# Altium project IPG.PrjPcb (part 3 of 13)

## Sheet 04-BLE.SchDoc: BLE Transreciver
size A3; DocumentNumber: 4; SheetNumber: 4; SheetTotal: 15
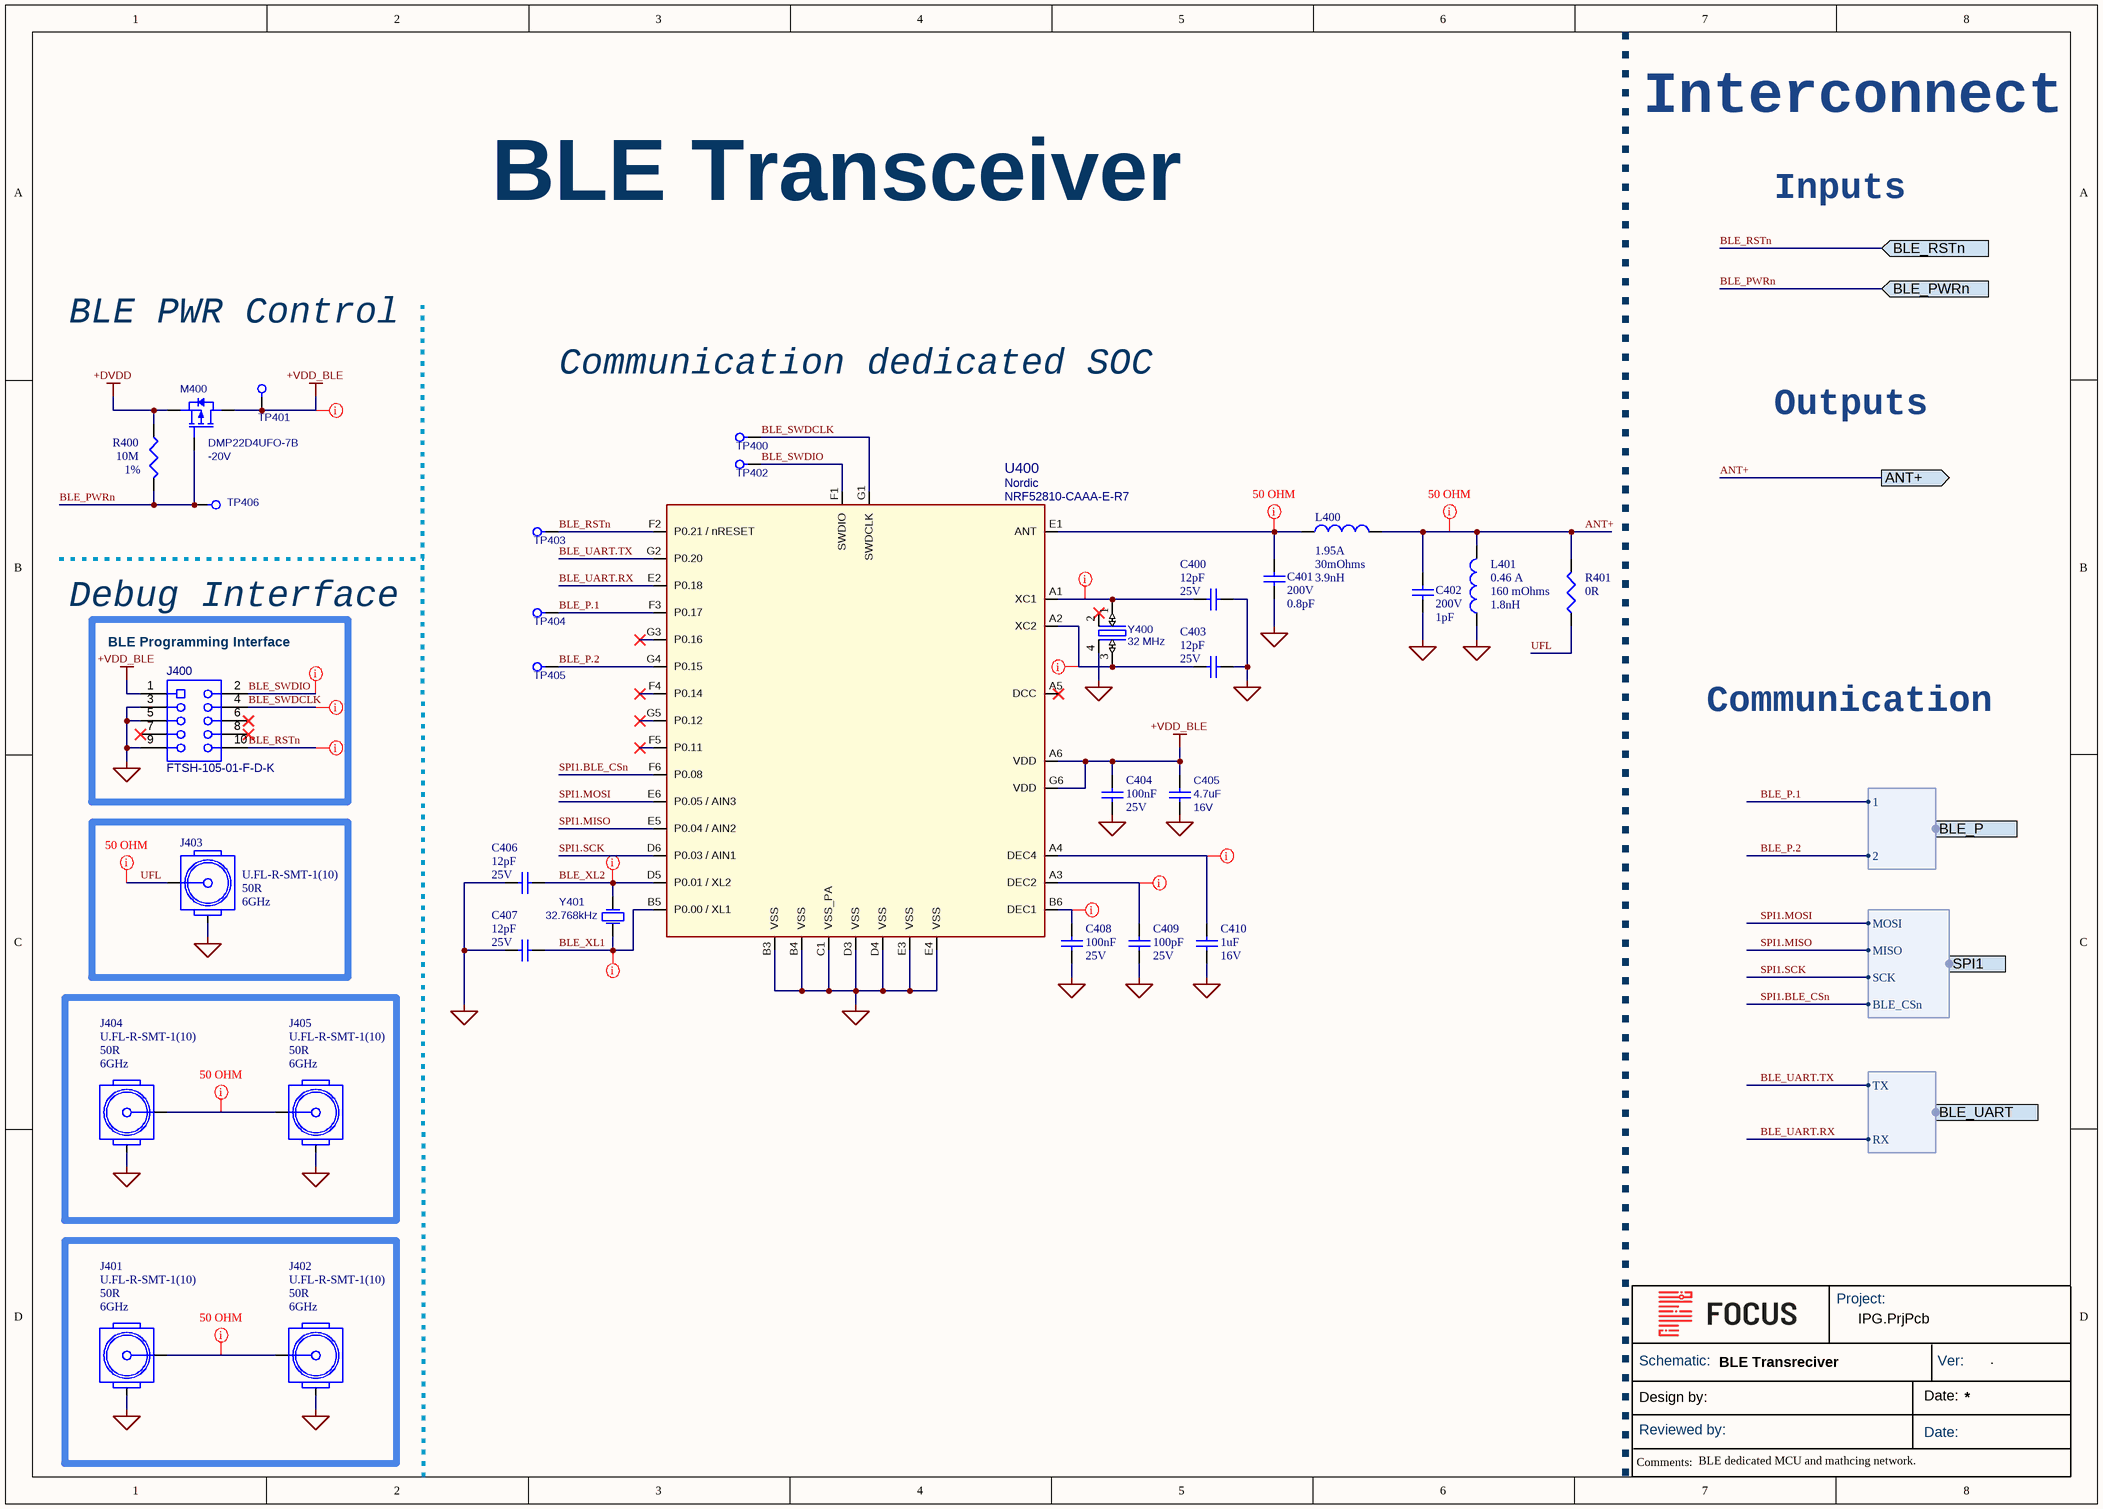
[diagram p9: 04-BLE.SchDoc]

### Parts
C400  value 12pF  Rated DC Voltage (URdc): 25V  [C0201_C]  (hidden comment: GRM0335C1E120JA01D)
C401  value 0.8pF  Voltage Rating: 200V  [CAP0402_REDUCED]  (hidden comment: 600L0R8AT200T)
C402  value 1pF  Voltage Rating: 200V  [CAP0402_REDUCED]  (hidden comment: 600L1R0AT200T)
C403  value 12pF  Rated DC Voltage (URdc): 25V  [C0201_C]  (hidden comment: GRM0335C1E120JA01D)
C404  value 100nF  Rated DC Voltage (URdc): 25V  [C0201_C]  (hidden comment: GRM033R61E104KE14J)
C405  value 4.7uF  Rating: 16V  [CAP0603_REDUCED]  (hidden comment: GRM188R61C475KE11)
C406  value 12pF  Rated DC Voltage (URdc): 25V  [C0201_C]  (hidden comment: GRM0335C1E120JA01D)
C407  value 12pF  Rated DC Voltage (URdc): 25V  [C0201_C]  (hidden comment: GRM0335C1E120JA01D)
C408  value 100nF  Rated DC Voltage (URdc): 25V  [C0201_C]  (hidden comment: GRM033R61E104KE14J)
C409  value 100pF  Rated DC Voltage (URdc): 25V  [C0201_C]  (hidden comment: GRM033R71E101KA01D)
C410  value 1uF  Rated DC Voltage (URdc): 16V  [C0201_C]  (hidden comment: GRM033R61C105ME15D)
J400  FTSH-105-01-F-D-K  [SAMTEC_FTSH-105-01-XXX-D-K]
J401  U.FL-R-SMT-1(10)  Characteristic Impedance: 50R  Operating Frequency-Max: 6GHz  [FP-U_FL-R-SMT-1_10-MFG]
J402  U.FL-R-SMT-1(10)  Characteristic Impedance: 50R  Operating Frequency-Max: 6GHz  [FP-U_FL-R-SMT-1_10-MFG]
J403  U.FL-R-SMT-1(10)  Characteristic Impedance: 50R  Operating Frequency-Max: 6GHz  [FP-U_FL-R-SMT-1_10-MFG]
J404  U.FL-R-SMT-1(10)  Characteristic Impedance: 50R  Operating Frequency-Max: 6GHz  [FP-U_FL-R-SMT-1_10-MFG]
J405  U.FL-R-SMT-1(10)  Characteristic Impedance: 50R  Operating Frequency-Max: 6GHz  [FP-U_FL-R-SMT-1_10-MFG]
L400  value 3.9nH  Current Rating: 1.95A  DC Resistance: 30mOhms  [L0402_C]  (hidden comment: LQW15AN3N9G80D)
L401  value 1.8nH  Current Rating: 0.46 A  DC Resistance: 160 mOhms  [L0402_C]  (hidden comment: LQW15AN1N8C00D)
M400  Rating: -20V  [DIODESINC_X2-DFN0604-3]  (hidden comment: DMP22D4UFO-7B)
R400  value 10M  Tolerance: 1%  [R0201_C]  (hidden comment: CRCW020110M0FNED)
R401  value 0R  [R0201_C]  (hidden comment: PA0201-R-070RL)
TP400  Test Point  [testpad_0.9mm]  (value not drawn)  (no BOM)
TP401  Test Point  [testpad_0.9mm]  (value not drawn)  (no BOM)
TP402  Test Point  [testpad_0.9mm]  (value not drawn)  (no BOM)
TP403  Test Point  [testpad_0.9mm]  (value not drawn)  (no BOM)
TP404  Test Point  [testpad_0.9mm]  (value not drawn)  (no BOM)
TP405  Test Point  [testpad_0.9mm]  (value not drawn)  (no BOM)
TP406  Test Point  [testpad_0.9mm]  (value not drawn)  (no BOM)
U400  Manufacturer: Nordic  [NORDIC_WLCSP_2.482x2.464]  (hidden comment: NRF52810-CAAA-E-R7)
Y400  value 32 MHz  [XTAL_ECS-SMD-CRYSTAL-10-48-CKY-TR]  (hidden comment: ECS-320-10-48-CKY-TR)
Y401  value 32.768kHz  [MICROCRYSTAL_CC8V-T1A]  (hidden comment: CM8V-T1A-32.768KHZ-6PF-20PPM-TA-QC)

### Ports
ANT+ (out), BLE_P (harness BLE PINS), BLE_PWRn (in), BLE_RSTn (in), BLE_UART (harness UART), SPI1 (harness BLE_SPI)

### Harnesses
BLE_SPI: MOSI, MISO, BLE_CSn, SCK
BLE PINS: 1, 2
UART: TX, RX

### Nets
+DVDD: M400.2(S) R400.1
+VDD_BLE: C404.2 C405.1 J400.1 M400.3(D) TP401.1 U400.A6(VDD) U400.G6(VDD)
GND: C400.2 C401.1 C402.1 C403.2 C404.1 C405.2 C406.1 C407.1 C408.1 C409.1 C410.2 J400.3 J400.5 J400.9 J401.2 J402.2 J403.2 J404.2 J405.2 L401.1 U400.B3(VSS) U400.B4(VSS) U400.C1(VSS_PA) U400.D3(VSS) U400.D4(VSS) U400.E3(VSS) U400.E4(VSS) Y400.4(GND)
ANT+: C402.2 L400.2 L401.2 R401.2 ; port ANT+
BLE_P.1: TP404.1 U400.F3(P0.17) ; port BLE_P.1
BLE_P.2: TP405.1 U400.G4(P0.15) ; port BLE_P.2
BLE_PWRn: M400.1(G) R400.2 TP406.1 ; port BLE_PWRn
BLE_RSTn: J400.10 TP403.1 U400.F2(P0.21_/_nRESET) ; port BLE_RSTn
BLE_SWDCLK: J400.4 TP400.1 U400.G1(SWDCLK)
BLE_SWDIO: J400.2 TP402.1 U400.F1(SWDIO)
BLE_UART.RX: U400.E2(P0.18) ; port BLE_UART.RX
BLE_UART.TX: U400.G2(P0.20) ; port BLE_UART.TX
BLE_XL1: C407.2 U400.B5(P0.00_/_XL1) Y401.1
BLE_XL2: C406.2 U400.D5(P0.01_/_XL2) Y401.2
SPI1.BLE_CSn: U400.F6(P0.08) ; port SPI1.BLE_CSn
SPI1.MISO: U400.E5(P0.04_/_AIN2) ; port SPI1.MISO
SPI1.MOSI: U400.E6(P0.05_/_AIN3) ; port SPI1.MOSI
SPI1.SCK: U400.D6(P0.03_/_AIN1) ; port SPI1.SCK
UFL: J403.1 R401.1
NetC400_1: C400.1 U400.A1(XC1) Y400.1(IN/OUT)
NetC401_2: C401.2 L400.1 U400.E1(ANT)
NetC403_1: C403.1 U400.A2(XC2) Y400.3(OUT/IN)
NetC408_2: C408.2 U400.B6(DEC1)
NetC409_2: C409.2 U400.A3(DEC2)
NetC410_1: C410.1 U400.A4(DEC4)
NetJ401_1: J401.1 J402.1
NetJ404_1: J404.1 J405.1

Not connected (* = marked no-connect by the designer): J400 6* 7* 8*; U400 A5(DCC)* F4(P0.14)* F5(P0.11)* G3(P0.16)* G5(P0.12)*; Y400 2(NC)*

### Layout directives
net class 50_OHM; rule Impedance Constraint [Min = 50.00    Max = 50.00    ]: ANT+, NetC401_2, NetJ401_1, NetJ404_1, UFL
net class DIGITAL: BLE_RSTn, BLE_SWDCLK, BLE_SWDIO, BLE_XL1, BLE_XL2, NetC400_1, NetC403_1
rule Supply Nets [Voltage = 3.300]; net class POWER: +VDD_BLE, NetC408_2, NetC409_2, NetC410_1

### Notes on the sheet
- Interconnect
- BLE Transceiver
- Inputs
- BLE PWR Control
- Communication dedicated SOC
- Outputs
- Debug Interface
- (near J400) BLE Programming Interface
- Communication
- BLE dedicated MCU and mathcing network.
- Project:
- Schematic:
- Ver:
- .
- Design by:
- Reviewed by:
- Date:
- Comments:

### Library data of the parts
C400 C403 C406 C407 = GRM0335C1E120JA01D: Ceramic Capacitor, Multilayer, Ceramic, 25V, 5% +Tol, 5% -Tol, C0G, 30ppm/Cel TC, 0.000012uF, Surface Mount, 0201; Manufacturer: Murata; Multilayer: Yes; Category: Ceramic Capacitors; Supplier: Digikey; Supplier Part Number: 490-3144-1-ND; Manufacturer Part Number: GRM0335C1E120JA01D; RoHS: Yes; Stock: 4384132; Pricing: 1=0,1, 10=0,011, 50=0,0062, 100=0,0048, 500=0,0036, 1000=0,00283, 2500=0,00258, 5000=0,00237 (USD); Mounting Technology: Surface Mount; Pins: 2; Dielectric Material: Ceramic; Package Shape: Rectangular; Case/Package: 0201; Terminal Finish: Nickel; Min Operating Temperature: -55°C; Max Operating Temperature: 125°C; Termination: Wraparound; JESD-609 Code: e3; Capacitor Type: Ceramic; Tolerance  (fill in as +-): 5%; Packaging: Tape and Reel; Tolerance (fill in as +-): 5%; Temperature Characteristics Code: C0G; Reach SVHC Compliant: Yes; RoHS Compliant: Yes; ComponentLink1URL: https://datasheet.ciiva.com:443/pdfs/VipMasterIC/IC/MURE/MURE-S-A0004347008/MURE-S-A0004348737-1.pdf?src-supplier=IHS+Markit; ComponentLink1Description: https://datasheet.ciiva.com:443/pdfs/VipMasterIC/IC/MURE/MURE-S-A0004347008/MURE-S-A0004348737-1.pdf?src-supplier=IHS+Markit; Supplier 1: Arrow Electronics; Supplier Part Number 1: GRM0335C1E120JA01D
C401 = 600L0R8AT200T: Capacitor, 0.8pF, Silicon RF, 200V, Tolerance 0.05pF, 0402, Implant-grade; Manufacturer: Kyocera AVX; Medical Grade Manufacturer: TBD; Temperature Coefficient: 30 ppm/°C; Category: Capacitor; Manufacturer Part Number: 600L0R8AT200T; Medical Grade Manufacturer Part Number: TBD; Size Code: 0402; Supplier: TBD; Supplier Part Number: TBD; Height: 0.6mm; Width: 0.51mm; Length: 1.05mm; Tolerance: 0.05pF; Dielectric: -; Supplier 1: Mouser; Supplier Part Number 1: 581-600L0R8AT
C402 = 600L1R0AT200T: Capacitor, 1pF, RF Capacitors, 200V, Tolerance 0.01pF, 0402, Implant-grade; Manufacturer: Kyocera AVX; Medical Grade Manufacturer: TBD; Temperature Coefficient: 30 ppm/°C; Category: Capacitor; Manufacturer Part Number: 600L1R0AT200T; Medical Grade Manufacturer Part Number: TBD; Size Code: 0402; Supplier: TBD; Supplier Part Number: TBD; Height: 0.6mm; Width: 0.51mm; Length: 1.02mm; Tolerance: 0.01pF; Dielectric: -; Supplier 1: Mouser; Supplier Part Number 1: 581-600L1R0AT
C404 C408 = GRM033R61E104KE14J: as C601 on sheet 06-BatteryManagement; Category: Ceramic Capacitors; Supplier: Digikey; Supplier Part Number: 490-14571-1-ND; Manufacturer Part Number: GRM033R61E104KE14J; RoHS: Yes; Stock: 1540851; Pricing: 1=0,1, 10=0,033, 50=0,0192, 100=0,0148, 500=0,01118, 1000=0,00878, 2500=0,00798, 5000=0,00734 (USD); Mounting Technology: Surface Mount; Pins: 2; Dielectric Material: Ceramic; Package Shape: Rectangular; Case/Package: 0201; Terminal Finish: Nickel; Min Operating Temperature: -55°C; Max Operating Temperature: 85°C; JESD-609 Code: e3; Capacitor Type: Ceramic; Tolerance  (fill in as +-): 10%; Package Style: SMTMeter; Packaging: Tape and Reel; Tolerance (fill in as +-): 10%; Temperature Characteristics Code: X5R; Termination: Wraparound; Length: 0.6mm; Width: 0.3mm; Height: 0.3mm; Reach SVHC Compliant: Yes; RoHS Compliant: Yes; ComponentLink1URL: https://psearch.en.murata.com:443/capacitor/product/GRM033R61E104KE14%23.pdf?src-supplier=IHS+Markit; ComponentLink1Description: https://psearch.en.murata.com:443/capacitor/product/GRM033R61E104KE14%23.pdf?src-supplier=IHS+Markit; ComponentLink2URL: http://www.mouser.com/ds/2/281/c02e-2905.pdf?src-supplier=Mouser; ComponentLink2Description: http://www.mouser.com/ds/2/281/c02e-2905.pdf?src-supplier=Mouser; ComponentLink3URL: http://search.murata.co.jp/Ceramy/image/img/A01X/G101/ENG/GRM033R61E104KE14-01.pdf?src-supplier=Digikey; ComponentLink3Description: http://search.murata.co.jp/Ceramy/image/img/A01X/G101/ENG/GRM033R61E104KE14-01.pdf?src-supplier=Digikey; ComponentLink4URL: https://search.murata.co.jp/Ceramy/image/img/A01X/G101/ENG/GRM033R61E104KE14-01.pdf?src-supplier=Digikey; ComponentLink4Description: https://search.murata.co.jp/Ceramy/image/img/A01X/G101/ENG/GRM033R61E104KE14-01.pdf?src-supplier=Digikey; Supplier 1: Arrow Electronics; Supplier Part Number 1: GRM033R61E104KE14J
C405 = GRM188R61C475KE11: Capacitor, 4.7uF, X5R, 16V, 10%, 0603, Implant-grade; Manufacturer: Murata; Medical Grade MFR PN: GCH188R61C475KE11; Length (mm): 1.60 ±0.10; Medical Grade MFR: Murata; PCB Footprint: cap0603_reduced; Thickness (mm): 0.80 ±0.10; Width (mm): 0.80 ±0.10; Category: Capacitor; Package Description: 0603; Check: *; Supplier 1: Arrow Electronics; Supplier Part Number 1: GRM188R61C475KE11D; Status: *; Review: *; Manufacturer Part Number: GRM188R61C475KE11
C409 = GRM033R71E101KA01D: Ceramic Capacitor, Multilayer, Ceramic, 25V, 10% +Tol, 10% -Tol, X7R, 15% TC, 0.0001uF, Surface Mount, 0201; Manufacturer: Murata; Multilayer: Yes; Category: Ceramic Capacitors; Supplier: Digikey; Supplier Part Number: 490-3172-1-ND; Manufacturer Part Number: GRM033R71E101KA01D; RoHS: Yes; Stock: 605708; Pricing: 1=0,1, 10=0,01, 50=0,0056, 100=0,0043, 500=0,00324, 1000=0,00255, 2500=0,00232, 5000=0,00213 (USD); Mounting Technology: Surface Mount; Pins: 2; Dielectric Material: Ceramic; Package Shape: Rectangular; Case/Package: 0201; Terminal Finish: Nickel; Min Operating Temperature: -55°C; Max Operating Temperature: 125°C; JESD-609 Code: e3; Capacitor Type: Ceramic; Tolerance  (fill in as +-): 10%; Package Style: SMTMeter; Packaging: Tape and Reel; Tolerance (fill in as +-): 10%; Temperature Characteristics Code: X7R; Termination: Wraparound; Length: 0.6mm; Width: 0.3mm; Height: 0.3mm; Reach SVHC Compliant: Yes; RoHS Compliant: Yes; ComponentLink1URL: https://psearch.en.murata.com:443/capacitor/product/GRM033R71E101KA01%23.pdf?src-supplier=IHS+Markit; ComponentLink1Description: https://psearch.en.murata.com:443/capacitor/product/GRM033R71E101KA01%23.pdf?src-supplier=IHS+Markit; ComponentLink2URL: https://datasheet.ciiva.com/129/grm033r71e101ka01-01-129915.pdf?src-supplier=Digikey; ComponentLink2Description: https://datasheet.ciiva.com/129/grm033r71e101ka01-01-129915.pdf?src-supplier=Digikey; ComponentLink3URL: https://datasheet.ciiva.com/129/grm033r71e101ka01-01-129916.pdf?src-supplier=Digikey; ComponentLink3Description: https://datasheet.ciiva.com/129/grm033r71e101ka01-01-129916.pdf?src-supplier=Digikey; ComponentLink4URL: https://datasheet.ciiva.com/129/grm033r71e101ka01-01-129917.pdf?src-supplier=Digikey; ComponentLink4Description: https://datasheet.ciiva.com/129/grm033r71e101ka01-01-129917.pdf?src-supplier=Digikey; ComponentLink5URL: https://datasheet.ciiva.com/18184/getdatasheetpartid-228478-18184102.pdf?src-supplier=Verical; ComponentLink5Description: https://datasheet.ciiva.com/18184/getdatasheetpartid-228478-18184102.pdf?src-supplier=Verical; ComponentLink6URL: https://datasheet.ciiva.com/29199/455792-da-01-en-vs-kondensator-0201-29199171.pdf?src-supplier=Conrad; ComponentLink6Description: https://datasheet.ciiva.com/29199/455792-da-01-en-vs-kondensator-0201-29199171.pdf?src-supplier=Conrad; ComponentLink7URL: https://datasheet.ciiva.com/11605/product-11605541.pdf?src-supplier=Avnet; ComponentLink7Description: https://datasheet.ciiva.com/11605/product-11605541.pdf?src-supplier=Avnet; ComponentLink8URL: https://datasheet.ciiva.com/16370/product-16370826.pdf?src-supplier=Future+Electronics; ComponentLink8Description: https://datasheet.ciiva.com/16370/product-16370826.pdf?src-supplier=Future+Electronics; Supplier 1: Arrow Electronics; Supplier Part Number 1: GRM033R71E101KA01D
C410 = GRM033R61C105ME15D: as C600 on sheet 06-BatteryManagement; Category: Ceramic Capacitors; Supplier: Digikey; Supplier Part Number: 490-18654-1-ND; Manufacturer Part Number: GRM033R61C105ME15D; RoHS: No; Stock: 132893; Pricing: 1=0,16, 10=0,105, 50=0,0628, 100=0,0493, 500=0,03644, 1000=0,03017, 2500=0,02808, 5000=0,02569 (USD); Supplier 1: Avnet; Supplier Part Number 1: GRM033R61C105ME15D
J400 = FTSH-105-01-F-D-K: Connector, 1.27 mm, 2x5, Male, TH; Manufacturer: Samtec; Review: 020823; Value: FTSH-105-01-F-D-K; Supplier 1: Mouser; Supplier Part Number 1: 200-FTSH10501FDK; Status: Approved; Manufacturer Part Number: FTSH-105-01-F-D-K
J401-J405 = U.FL-R-SMT-1(10): RF Connector, 1 Contact(s), Male, Board Mount, Surface Mount Terminal, Receptacle; pin to pad: 2>2+3; Manufacturer: Hirose; Durability: 30Cycles; Insulation Resistance: 500MR; Number of Ports: 1; Option: General Purpose; Contact Resistance: 20mR; Contact Style: Coax; Coupling Type: Snap; Dielectric Withstanding Voltage (AC): 200V; Filter Feature: No; Mating Information: MULTIPLE MATING PARTS AVAILABLE; Panel Mount: No; VSWR: 1.5; Insertion Loss: 0.05dB; Body Depth: 0.098inch; Mounting Option 1: LOCKING; Body Diameter: 0.079inch; Reference Standard: UL; Reliability: COMMERCIAL; Supplier: Digi-Key; Supplier Part Number: H11891CT-ND; RoHS: Yes; Category: RF / Coaxial Connectors; Stock: 112692; Pricing: 1=1,35, 10=1,138, 25=1,092, 50=1,0686, 100=1,0221, 250=0,9292, 500=0,83628, 1000=0,74336 (USD); Mounting Technology: Board; Insulation Material: Polymer; Shell Finish: Silver; Shell Material: CuSn; Contact Material: Bronze; Contact Finish - Mating: GOLD; Contact Finish - Termination: GOLD; Insulation Color: Beige; Min Operating Temperature: -40°C; Max Operating Temperature: 90°C; Connector Type: RF CONNECTOR; Body/Shell Style: RECEPTACLE; Contact Gender: Male; Mounting Style: STRAIGHT; Termination: SMD/SMT; Number of Contacts: 1; JESD-609 Code: e4; Reach SVHC Compliant: Yes; RoHS Compliant: Yes; DIN Conformance: No; IEC Conformance: No; MIL Conformance: No; ComponentLink1URL: https://datasheet.ciiva.com:443/pdfs/VipMasterIC/IC/HIRO/HIROS10696/HIROS08829-1.pdf?src-supplier=IHS+Markit; ComponentLink1Description: https://datasheet.ciiva.com:443/pdfs/VipMasterIC/IC/HIRO/HIROS10696/HIROS08829-1.pdf?src-supplier=IHS+Markit; ComponentLink2URL: https://datasheet.ciiva.com/11762/0900766b8105243f-11762474.pdf?src-supplier=Rs; ComponentLink2Description: https://datasheet.ciiva.com/11762/0900766b8105243f-11762474.pdf?src-supplier=Rs; ComponentLink3URL: https://datasheet.ciiva.com/7651/91524-7651914.pdf?src-supplier=Element14; ComponentLink3Description: https://datasheet.ciiva.com/7651/91524-7651914.pdf?src-supplier=Element14; ComponentLink4URL: https://datasheet.ciiva.com/7651/91524-7651915.pdf?src-supplier=Element14; ComponentLink4Description: https://datasheet.ciiva.com/7651/91524-7651915.pdf?src-supplier=Element14; Manufacturer Part Number: U.FL-R-SMT-1(10); Supplier 1: Digikey; Supplier Part Number 1: H11891CT-ND
L400 = LQW15AN3N9G80D: Inductor, 3.9nH, 1.95A, 2%, 0402; Manufacturer: Murata; Medical Grade Manufacturer: TBD; Shielding: Unshielded; Category: Inductor; Temperature Coefficient: -; Manufacturer Part Number: LQW15AN3N9G80D; Medical Grade Manufacturer Part Number: TBD; Size Code: 0402; Supplier: TBD; Supplier Part Number: TBD; Height: 0.5mm; Width: 0.6mm; Length: 1mm; Tolerance: 2%; Current Saturation: -; Supplier 1: Mouser; Supplier Part Number 1: 81-LQW15AN3N9G80D; Supplier 2: Digikey; Supplier Part Number 2: 490-LQW15AN3N9G80DCT-ND; Supplier 3: Digikey; Supplier Part Number 3: 490-LQW15AN3N9G80DDKR-ND; Supplier 4: Digikey; Supplier Part Number 4: 490-LQW15AN3N9G80DTR-ND
L401 = LQW15AN1N8C00D: Inductor, 1.8nH, 0.46A, Tolerance 0.2 nH, 0402; Manufacturer: Murata; Medical Grade Manufacturer: TBD; Tolerance: 0.2 nH; Shielding: Unshielded; Category: Inductor; Temperature Coefficient: -; Manufacturer Part Number: LQW15AN1N8C00D; Medical Grade Manufacturer Part Number: TBD; Size Code: 0402; Supplier: TBD; Supplier Part Number: TBD; Height: 0.5mm; Width: 0.6mm; Length: 1mm; Current Saturation: -; Supplier 1: Mouser; Supplier Part Number 1: 81-LQW15AN1N8C00D; Supplier 2: Digikey; Supplier Part Number 2: 490-14479-1-ND; Supplier 3: Digikey; Supplier Part Number 3: 490-14479-6-ND; Supplier 4: Digikey; Supplier Part Number 4: 490-14479-2-ND
M400 = DMP22D4UFO-7B: MOSFET, P-chan, -20V, -383mA, DFN0604; Manufacturer: Diodes Inc; Medical Grade MFR: TBD; Review: 020823; Category: Transistor; Length (mm): 0.60 ±0.05; Medical Grade MFR PN: TBD; PCB Footprint: TBD; Thickness (mm): 0.36 ±0.04; Value: DMP22D4UFO-7B; Width (mm): 0.40 ±0.05; Supplier 1: Digi-Key; Supplier Part Number 1: 31-DMP22D4UFO-7BCT-ND; Status: Approved; Manufacturer Part Number: DMP22D4UFO-7B
R400 = CRCW020110M0FNED: as R600 on sheet 06-BatteryManagement; Category: Chip SMD Resistors; Supplier: Mouser; Supplier Part Number: 71-CRCW020110M0FNED; Manufacturer Part Number: CRCW020110M0FNED; RoHS: Yes; Stock: 159754; Pricing: 1=0,1, 10=0,024, 50=0,024, 100=0,014, 1000=0,011, 10000=0,006 (USD); Mounting Technology: Surface Mount; Pins: 2; Package Shape: Rectangular; Case/Package: 0201; Terminal Finish: Nickel; Min Operating Temperature: -55°C; Max Operating Temperature: 155°C; JESD-609 Code: e3; Resistor Type: FIXED RESISTOR; Packaging: Tape and Reel; Technology: METAL GLAZE/THICK FILM; Termination: Wraparound; Working Voltage: 30V; Reach SVHC Compliant: Yes; RoHS Compliant: Yes; ComponentLink1URL: https://datasheet.ciiva.com:443/pdfs/VipMasterIC/IC/VISH/VISH-S-A0002932828/VISH-S-A0002932828-1.pdf?src-supplier=IHS+Markit; ComponentLink1Description: https://datasheet.ciiva.com:443/pdfs/VipMasterIC/IC/VISH/VISH-S-A0002932828/VISH-S-A0002932828-1.pdf?src-supplier=IHS+Markit; ComponentLink2URL: https://datasheet.ciiva.com/7673/1719906-7673177.pdf?src-supplier=Element14; ComponentLink2Description: https://datasheet.ciiva.com/7673/1719906-7673177.pdf?src-supplier=Element14; ComponentLink3URL: https://datasheet.ciiva.com/7673/1719906-7673178.pdf?src-supplier=Element14; ComponentLink3Description: https://datasheet.ciiva.com/7673/1719906-7673178.pdf?src-supplier=Element14; ComponentLink4URL: https://datasheet.ciiva.com/22692/1719906-22692711.pdf?src-supplier=Element14; ComponentLink4Description: https://datasheet.ciiva.com/22692/1719906-22692711.pdf?src-supplier=Element14; ComponentLink5URL: https://datasheet.ciiva.com/22665/1700795-22665701.pdf?src-supplier=Element14; ComponentLink5Description: https://datasheet.ciiva.com/22665/1700795-22665701.pdf?src-supplier=Element14; Supplier 1: Digikey; Supplier Part Number 1: 541-CRCW020110M0FNEDCT-ND
R401 = PA0201-R-070RL: Resistor, 0 Ohm, 0201, Metal element, Non-Implant grade,; Manufacturer: YAGEO; Temperature Coefficient: 150 ppm/°C; Category: Resistor; Manufacturer Part Number: PA0201-R-070RL; Medical Grade Manufacturer: -; Medical Grade Manufacturer Part Number: -; Size Code: 0201; Supplier: TBD; Supplier Part Number: TBD; Voltage Rating: *
TP400-TP406 = Test Point: as TP600 on sheet 06-BatteryManagement; Length (mm): 0.90; Manufacturer: N/A; Manufacturer PN: N/A; Medical Grade MFR: N/A; Medical Grade MFR PN: N/A; Rating: N/A; Thickness (mm): N/A; Value: Test point; Width (mm): 0.90; Category: Test point; Status: *; Review: *
U400 = NRF52810-CAAA-E-R7: Bluetooth radio, v5.0, 192 kB Flash, 24 kB RAM, BGA-33; Medical Grade MFR: TBD; Category: IC; Length (mm): 2.48; Medical Grade MFR PN: TBD; Package Description: TBD; PCB Footprint: TBD; Rating: TBD; Thickness (mm): 0.48 ±0.06; Value: NRF52810-CAAA-E-R7; Width (mm): 2.46; Supplier 1: DigiKey; Supplier Part Number 1: 4823-NRF52810-CAAA-E-R7CT-ND; Status: *; Review: *; Manufacturer Part Number: NRF52810-CAAA-E-R7
Y400 = ECS-320-10-48-CKY-TR: 32 MHz Â±10ppm Crystal 10pF 100 Ohms 4-SMD, No Lead; Manufacturer: ECS Inc.; Medical Grade MFR: TBD; Category: Crystal; Length (mm): 1.20; Medical Grade MFR PN: TBD; PCB Footprint: TBD; Rating: N/A; Thickness (mm): 0.33; Width (mm): 1.00; Package Description: 4-SMD, No Lead; Supplier 1: Digi-Key; Supplier Part Number 1: XC3036CT-ND; Status: *; Review: *; Manufacturer Part Number: ECS-320-10-48-CKY-TR
Y401 = CM8V-T1A-32.768KHZ-6PF-20PPM-TA-QC: CRYSTAL 32.7680KHZ 6PF SMD; Manufacturer: Micro Crystal; Medical Grade MFR PN: CC8V-T1A32.768kHz6.0pF±20ppmTAQM; PCB Footprint: TBD; Review: 020823; Category: Crystal; Length (mm): 2.00; Medical Grade MFR: Micro Crystal; Rating: N/A; Thickness (mm): 0.67; Width (mm): 1.20; Package Description: CC8V; Supplier 1: Digi-Key; Supplier Part Number 1: 2195-CM8V-T1A-32.768KHZ-6PF-20PPM-TA-QCCT-ND; Status: Approved; Manufacturer Part Number: CM8V-T1A-32.768KHZ-6PF-20PPM-TA-QC

## Sheet 12-Electrodes.SchDoc: Electrodes
size A2; DocumentNumber: 12; SheetNumber: 12; SheetTotal: 15
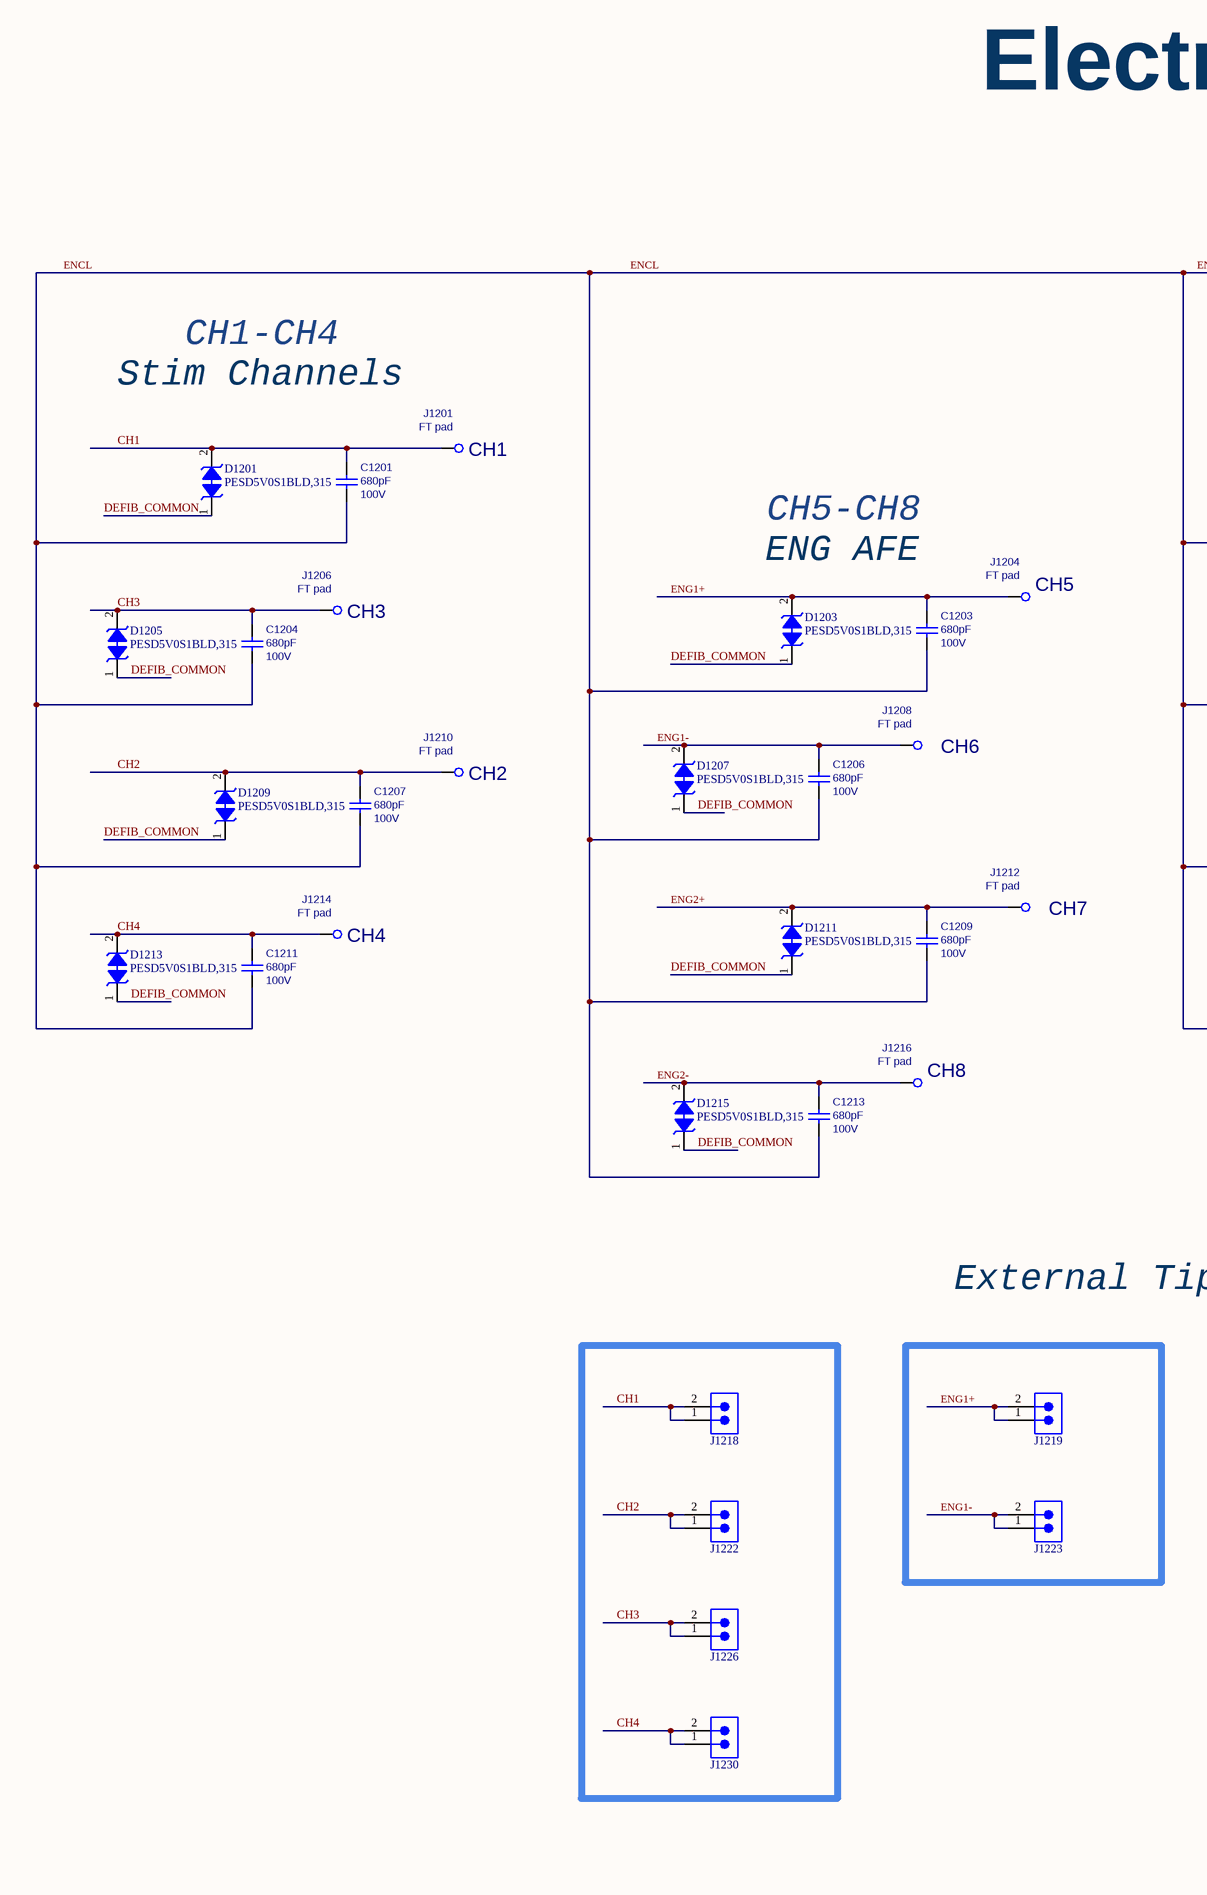
[diagram p10: 12-Electrodes.SchDoc, left]
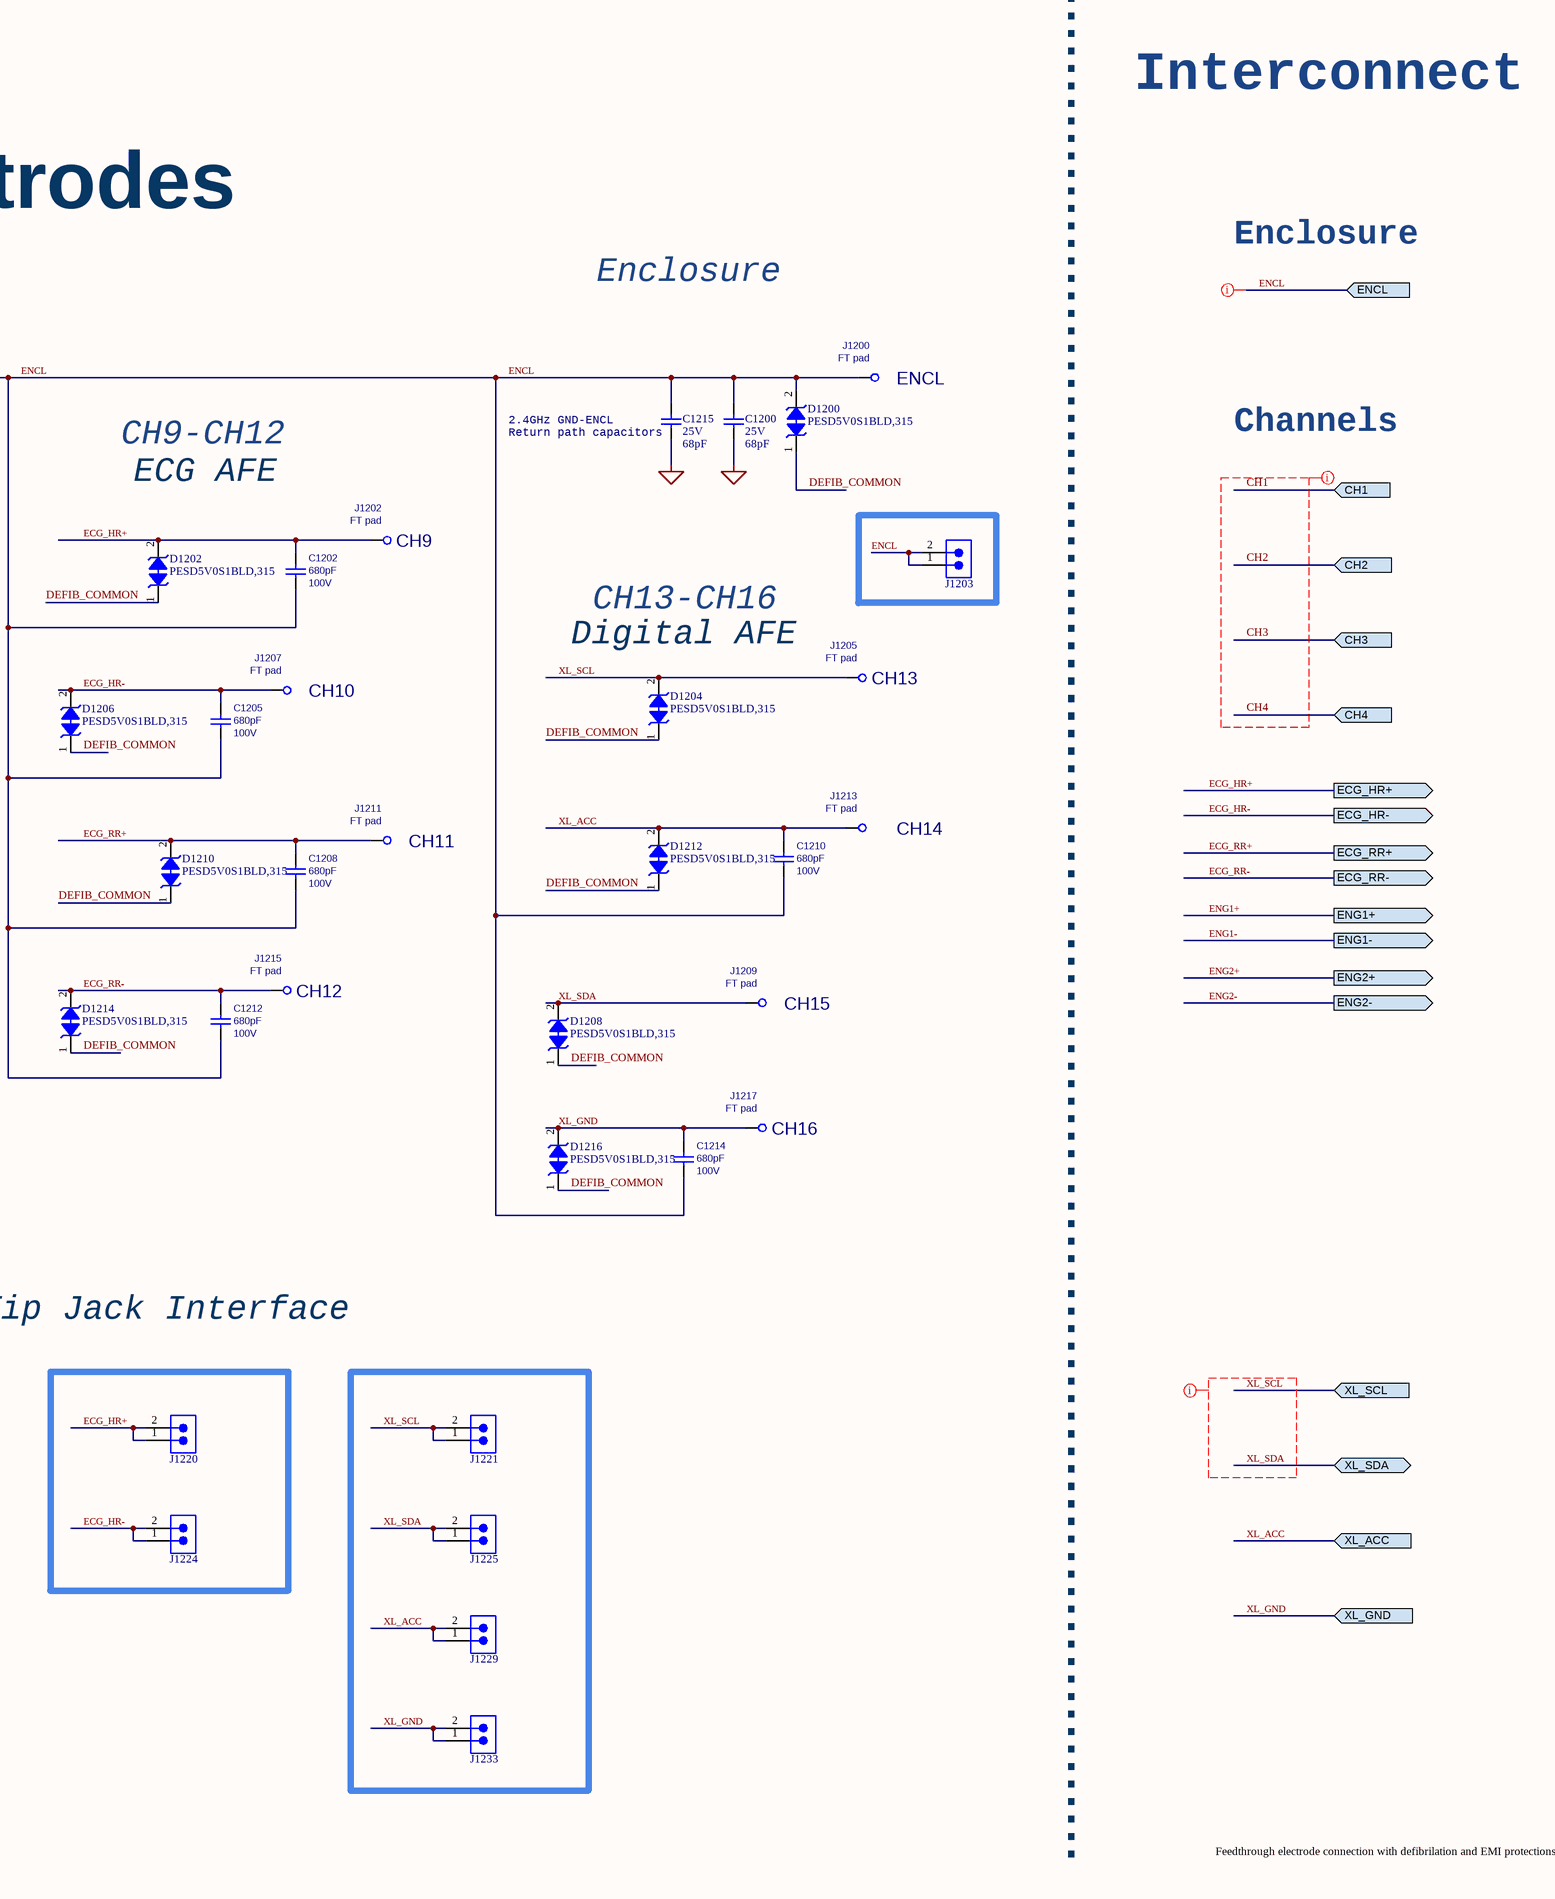
[diagram p11: 12-Electrodes.SchDoc, right]

### Parts
C1200  value 68pF  Voltage Rating: 25V  [C0201_C]  (hidden comment: GRT0335C1E680JA02D)
C1201  value 680pF  Rating: 100V  [CAP0402_REDUCED]  (hidden comment: C1005C0G2A681J050BE)
C1202  value 680pF  Rating: 100V  [CAP0402_REDUCED]  (hidden comment: C1005C0G2A681J050BE)
C1203  value 680pF  Rating: 100V  [CAP0402_REDUCED]  (hidden comment: C1005C0G2A681J050BE)
C1204  value 680pF  Rating: 100V  [CAP0402_REDUCED]  (hidden comment: C1005C0G2A681J050BE)
C1205  value 680pF  Rating: 100V  [CAP0402_REDUCED]  (hidden comment: C1005C0G2A681J050BE)
C1206  value 680pF  Rating: 100V  [CAP0402_REDUCED]  (hidden comment: C1005C0G2A681J050BE)
C1207  value 680pF  Rating: 100V  [CAP0402_REDUCED]  (hidden comment: C1005C0G2A681J050BE)
C1208  value 680pF  Rating: 100V  [CAP0402_REDUCED]  (hidden comment: C1005C0G2A681J050BE)
C1209  value 680pF  Rating: 100V  [CAP0402_REDUCED]  (hidden comment: C1005C0G2A681J050BE)
C1210  value 680pF  Rating: 100V  [CAP0402_REDUCED]  (hidden comment: C1005C0G2A681J050BE)
C1211  value 680pF  Rating: 100V  [CAP0402_REDUCED]  (hidden comment: C1005C0G2A681J050BE)
C1212  value 680pF  Rating: 100V  [CAP0402_REDUCED]  (hidden comment: C1005C0G2A681J050BE)
C1213  value 680pF  Rating: 100V  [CAP0402_REDUCED]  (hidden comment: C1005C0G2A681J050BE)
C1214  value 680pF  Rating: 100V  [CAP0402_REDUCED]  (hidden comment: C1005C0G2A681J050BE)
C1215  value 68pF  Voltage Rating: 25V  [C0201_C]  (hidden comment: GRT0335C1E680JA02D)
D1200  PESD5V0S1BLD,315  [PESD5V0S1BLD315]
D1201  PESD5V0S1BLD,315  [PESD5V0S1BLD315]
D1202  PESD5V0S1BLD,315  [PESD5V0S1BLD315]
D1203  PESD5V0S1BLD,315  [PESD5V0S1BLD315]
D1204  PESD5V0S1BLD,315  [PESD5V0S1BLD315]
D1205  PESD5V0S1BLD,315  [PESD5V0S1BLD315]
D1206  PESD5V0S1BLD,315  [PESD5V0S1BLD315]
D1207  PESD5V0S1BLD,315  [PESD5V0S1BLD315]
D1208  PESD5V0S1BLD,315  [PESD5V0S1BLD315]
D1209  PESD5V0S1BLD,315  [PESD5V0S1BLD315]
D1210  PESD5V0S1BLD,315  [PESD5V0S1BLD315]
D1211  PESD5V0S1BLD,315  [PESD5V0S1BLD315]
D1212  PESD5V0S1BLD,315  [PESD5V0S1BLD315]
D1213  PESD5V0S1BLD,315  [PESD5V0S1BLD315]
D1214  PESD5V0S1BLD,315  [PESD5V0S1BLD315]
D1215  PESD5V0S1BLD,315  [PESD5V0S1BLD315]
D1216  PESD5V0S1BLD,315  [PESD5V0S1BLD315]
J1200  value FT pad  [FEEDHOLE_20mil]  (hidden comment: THPAD_20m)  (no BOM)
J1201  value FT pad  [FEEDHOLE_20mil]  (hidden comment: THPAD_20m)  (no BOM)
J1202  value FT pad  [FEEDHOLE_20mil]  (hidden comment: THPAD_20m)  (no BOM)
J1203  TSW-102-26-G-S  [SMTC-TSW-102-26-XX-S]  (value not drawn)
J1204  value FT pad  [FEEDHOLE_20mil]  (hidden comment: THPAD_20m)  (no BOM)
J1205  value FT pad  [FEEDHOLE_20mil]  (hidden comment: THPAD_20m)  (no BOM)
J1206  value FT pad  [FEEDHOLE_20mil]  (hidden comment: THPAD_20m)  (no BOM)
J1207  value FT pad  [FEEDHOLE_20mil]  (hidden comment: THPAD_20m)  (no BOM)
J1208  value FT pad  [FEEDHOLE_20mil]  (hidden comment: THPAD_20m)  (no BOM)
J1209  value FT pad  [FEEDHOLE_20mil]  (hidden comment: THPAD_20m)  (no BOM)
J1210  value FT pad  [FEEDHOLE_20mil]  (hidden comment: THPAD_20m)  (no BOM)
J1211  value FT pad  [FEEDHOLE_20mil]  (hidden comment: THPAD_20m)  (no BOM)
J1212  value FT pad  [FEEDHOLE_20mil]  (hidden comment: THPAD_20m)  (no BOM)
J1213  value FT pad  [FEEDHOLE_20mil]  (hidden comment: THPAD_20m)  (no BOM)
J1214  value FT pad  [FEEDHOLE_20mil]  (hidden comment: THPAD_20m)  (no BOM)
J1215  value FT pad  [FEEDHOLE_20mil]  (hidden comment: THPAD_20m)  (no BOM)
J1216  value FT pad  [FEEDHOLE_20mil]  (hidden comment: THPAD_20m)  (no BOM)
J1217  value FT pad  [FEEDHOLE_20mil]  (hidden comment: THPAD_20m)  (no BOM)
J1218  TSW-102-26-G-S  [SMTC-TSW-102-26-XX-S]  (value not drawn)
J1219  TSW-102-26-G-S  [SMTC-TSW-102-26-XX-S]  (value not drawn)
J1220  TSW-102-26-G-S  [SMTC-TSW-102-26-XX-S]  (value not drawn)
J1221  TSW-102-26-G-S  [SMTC-TSW-102-26-XX-S]  (value not drawn)
J1222  TSW-102-26-G-S  [SMTC-TSW-102-26-XX-S]  (value not drawn)
J1223  TSW-102-26-G-S  [SMTC-TSW-102-26-XX-S]  (value not drawn)
J1224  TSW-102-26-G-S  [SMTC-TSW-102-26-XX-S]  (value not drawn)
J1225  TSW-102-26-G-S  [SMTC-TSW-102-26-XX-S]  (value not drawn)
J1226  TSW-102-26-G-S  [SMTC-TSW-102-26-XX-S]  (value not drawn)
J1229  TSW-102-26-G-S  [SMTC-TSW-102-26-XX-S]  (value not drawn)
J1230  TSW-102-26-G-S  [SMTC-TSW-102-26-XX-S]  (value not drawn)
J1233  TSW-102-26-G-S  [SMTC-TSW-102-26-XX-S]  (value not drawn)

### Ports
CH1 (in), CH2 (in), CH3 (in), CH4 (in), ECG_HR+ (out), ECG_HR- (out), ECG_RR+ (out), ECG_RR- (out), ENCL (in), ENG1+ (out), ENG1- (out), ENG2+ (out), ENG2- (out), XL_ACC (in), XL_GND (in), XL_SCL (in), XL_SDA (bidir)

### Nets
GND: C1200.1 C1215.1
CH1: C1201.2 D1201.2(K2) J1201.1 J1218.1 J1218.2 ; port CH1
CH2: C1207.2 D1209.2(K2) J1210.1 J1222.1 J1222.2 ; port CH2
CH3: C1204.2 D1205.2(K2) J1206.1 J1226.1 J1226.2 ; port CH3
CH4: C1211.2 D1213.2(K2) J1214.1 J1230.1 J1230.2 ; port CH4
DEFIB_COMMON: D1200.1(K1) D1201.1(K1) D1202.1(K1) D1203.1(K1) D1204.1(K1) D1205.1(K1) D1206.1(K1) D1207.1(K1) D1208.1(K1) D1209.1(K1) D1210.1(K1) D1211.1(K1) D1212.1(K1) D1213.1(K1) D1214.1(K1) D1215.1(K1) D1216.1(K1)
ECG_HR+: C1202.2 D1202.2(K2) J1202.1 J1220.1 J1220.2 ; port ECG_HR+
ECG_HR-: C1205.2 D1206.2(K2) J1207.1 J1224.1 J1224.2 ; port ECG_HR-
ECG_RR+: C1208.2 D1210.2(K2) J1211.1 ; port ECG_RR+
ECG_RR-: C1212.2 D1214.2(K2) J1215.1 ; port ECG_RR-
ENCL: C1200.2 C1201.1 C1202.1 C1203.1 C1204.1 C1205.1 C1206.1 C1207.1 C1208.1 C1209.1 C1210.1 C1211.1 C1212.1 C1213.1 C1214.1 C1215.2 D1200.2(K2) J1200.1 J1203.1 J1203.2 ; port ENCL
ENG1+: C1203.2 D1203.2(K2) J1204.1 J1219.1 J1219.2 ; port ENG1+
ENG1-: C1206.2 D1207.2(K2) J1208.1 J1223.1 J1223.2 ; port ENG1-
ENG2+: C1209.2 D1211.2(K2) J1212.1 ; port ENG2+
ENG2-: C1213.2 D1215.2(K2) J1216.1 ; port ENG2-
XL_ACC: C1210.2 D1212.2(K2) J1213.1 J1229.1 J1229.2 ; port XL_ACC
XL_GND: C1214.2 D1216.2(K2) J1217.1 J1233.1 J1233.2 ; port XL_GND
XL_SCL: D1204.2(K2) J1205.1 J1221.1 J1221.2 ; port XL_SCL
XL_SDA: D1208.2(K2) J1209.1 J1225.1 J1225.2 ; port XL_SDA

### Layout directives
net class ANALOG: CH1, CH2, CH3, CH4, ENCL
net class DIGITAL: XL_SCL, XL_SDA

### Notes on the sheet
- Interconnect
- Electrodes
- Enclosure
- 2.4GHz GND-ENCL
- (near J1200) ENCL
- Stim Channels
- CH1-CH4
- CH9-CH12
- ECG AFE
- (near C1215) Return path capacitors
- Channels
- (near J1201) CH1
- (near J1202) CH9
- CH5-CH8
- CH13-CH16
- ENG AFE
- (near J1204) CH5
- (near D1204) Digital AFE
- (near J1206) CH3
- (near J1207) CH10
- (near J1205) CH13
- (near J1210) CH2
- (near J1208) CH6
- (near J1211) CH11
- (near J1213) CH14
- (near J1212) CH7
- (near J1214) CH4
- (near J1215) CH12
- (near J1209) CH15
- (near J1216) CH8
- (near J1217) CH16
- External Tip Jack Interface
- Feedthrough electrode connection with defibrilation and EMI protections.
- Project:
- Schematic:
- Design by:
- Date:
- Ver:
- .
- Comments:
- Reviewed by:

### Library data of the parts
C1200 C1215 = GRT0335C1E680JA02D: Capacitor, 68pF, C0G, 25V, 5%, 0201, Implant-grade; Manufacturer: Murata; Medical Grade Manufacturer: TBD; Category: Capacitor; Manufacturer Part Number: GRT0335C1E680JA02D; Medical Grade Manufacturer Part Number: TBD; Size Code: Size Code; Supplier: TBD; Supplier Part Number: TBD; Height: 0.3mm; Width: 0.3mm; Length: 0.6mm; Tolerance: 5%; Dielectric: C0G; Supplier 1: Mouser; Supplier Part Number 1: 81-GRT0335C1E680JA2D; Supplier 2: Digikey; Supplier Part Number 2: 490-GRT0335C1E680JA02DTR-ND
C1201-C1214 = C1005C0G2A681J050BE: Capacitor, 680pF, C0G, 100V, 5%, 0402; Manufacturer: TDK; Medical Grade MFR: TBD; Review: 020823; Length (mm): 1.00 ±0.10; Medical Grade MFR PN: TBD; PCB Footprint: TBD; Thickness (mm): 0.50 ±0.10; Width (mm): 0.50 ±0.10; Category: Capacitor; Package Description: 0402; Supplier 1: Arrow Electronics; Supplier Part Number 1: C1005C0G2A681J050BE; Status: Approved; Manufacturer Part Number: C1005C0G2A681J050BE
D1200-D1216 = PESD5V0S1BLD,315: Diode ESD (Bi-directional); Manufacturer: Nexperia; Datasheet Link: https://assets.nexperia.com/documents/data-sheet/PESD5V0S1BLD.pdf; Height: 0.4mm; Mouser Part Number: 771-PESD5V0S1BLD315; Mouser Price/Stock: https://www.mouser.co.uk/ProductDetail/Nexperia/PESD5V0S1BLD315?qs=A1cBxND5mHLYeryYrbux2w%3D%3D; Arrow Part Number: PESD5V0S1BLD,315; Arrow Price/Stock: https://www.arrow.com/en/products/pesd5v0s1bld315/nexperia?region=nac; Manufacturer Part Number: PESD5V0S1BLD,315; Supplier 1: Future Electronics; Supplier Part Number 1: 8158301
J1200-J1202 J1204-J1217 = HOLE_20m: as J200 on sheet 02-System; Category: FT pad; Length (mm): TBD; Manufacturer: N/A; Manufacturer PN: N/A; Medical Grade MFR: N/A; Medical Grade MFR PN: N/A; Rating: N/A; Thickness (mm): N/A; Width (mm): TBD; Package Description: FT pad; Status: *; Review: *
J1203 J1218-J1226 J1229 J1230 J1233 = TSW-102-26-G-S: as J602 on sheet 06-BatteryManagement; Category: Connectors; Supplier 1: Digikey; Supplier Part Number 1: SAM1077-02-ND; Stock: 3117; Manufacturer Part Number: TSW-102-26-G-S; Orientation: Vertical; ComponentLink3Description: Package Specification; PackageReference: TSW-102-26-XX-S; Mounting Technology: Through-hole; ComponentLink2Description: Datasheet; ComponentLink1URL: http://www.samtec.com; DatasheetVersion: F-214; ComponentLink1Description: Manufacturer URL; RoHS: True; ComponentLink2URL: http://www.samtec.com/documents/webfiles/pdf/TSW_TH.PDF; PartNumber: TSW-102-26-G-S; ComponentLink3URL: http://www.samtec.com/documents/webfiles/cpdf/TSW-XXX-XX-XXX-X-XX-XXX-MKT.pdf; Pitch: 2.54 mm; PackageDescription: .025[0.64] SQ. Post Terminal Strip Assembly; PackageVersion: DM, 8/1988; Temperature Range: -55 to 125 degC; Supplier: Newark; Supplier Part Number: 12P1301; Pricing: 1=0.51000, 10=0.47500, 100=0.33200, 500=0.28400, 1000=0.23700, 2500=0.21000, 5000=0.20400 (USD); Contact Plating: Gold; Contact Material: Bronze; Color: Black; Housing Material: Polyester; Contact Shape: Square; Contact Finish - Mating: GOLD; Insulation Color: Black; Insulation Material: PBT; Housing Color: Black; Min Operating Temperature: -55°C; Max Operating Temperature: 125°C; Number of Rows: 1; Packaging: Bulk; Termination: Solder; Number of Positions: 2; Connector Type: Header; Series: TSW; Contact Type: Male Pin; Fastening Type: Pull; Package Quantity: 1; Length: 5.08mm; Width: 2.54mm; Contact Mating Length: 0.23inch; Depth: 2.54mm; Radiation Hardening: No; RoHS Compliant: Yes; Flammability Rating: UL94 V-0; Lead Free: Lead Free; Reach SVHC Compliant: Yes; ComponentLink4URL: https://datasheet.ciiva.com/10281/htsw-th-10281416.pdf?src-supplier=Avnet; ComponentLink4Description: https://datasheet.ciiva.com/10281/htsw-th-10281416.pdf?src-supplier=Avnet; ComponentLink5URL: https://datasheet.ciiva.com/6887/tsw-xxx-xx-xxx-x-xx-xxx-mkt-6887237.pdf?src-supplier=Digi-Key; ComponentLink5Description: https://datasheet.ciiva.com/6887/tsw-xxx-xx-xxx-x-xx-xxx-mkt-6887237.pdf?src-supplier=Digi-Key